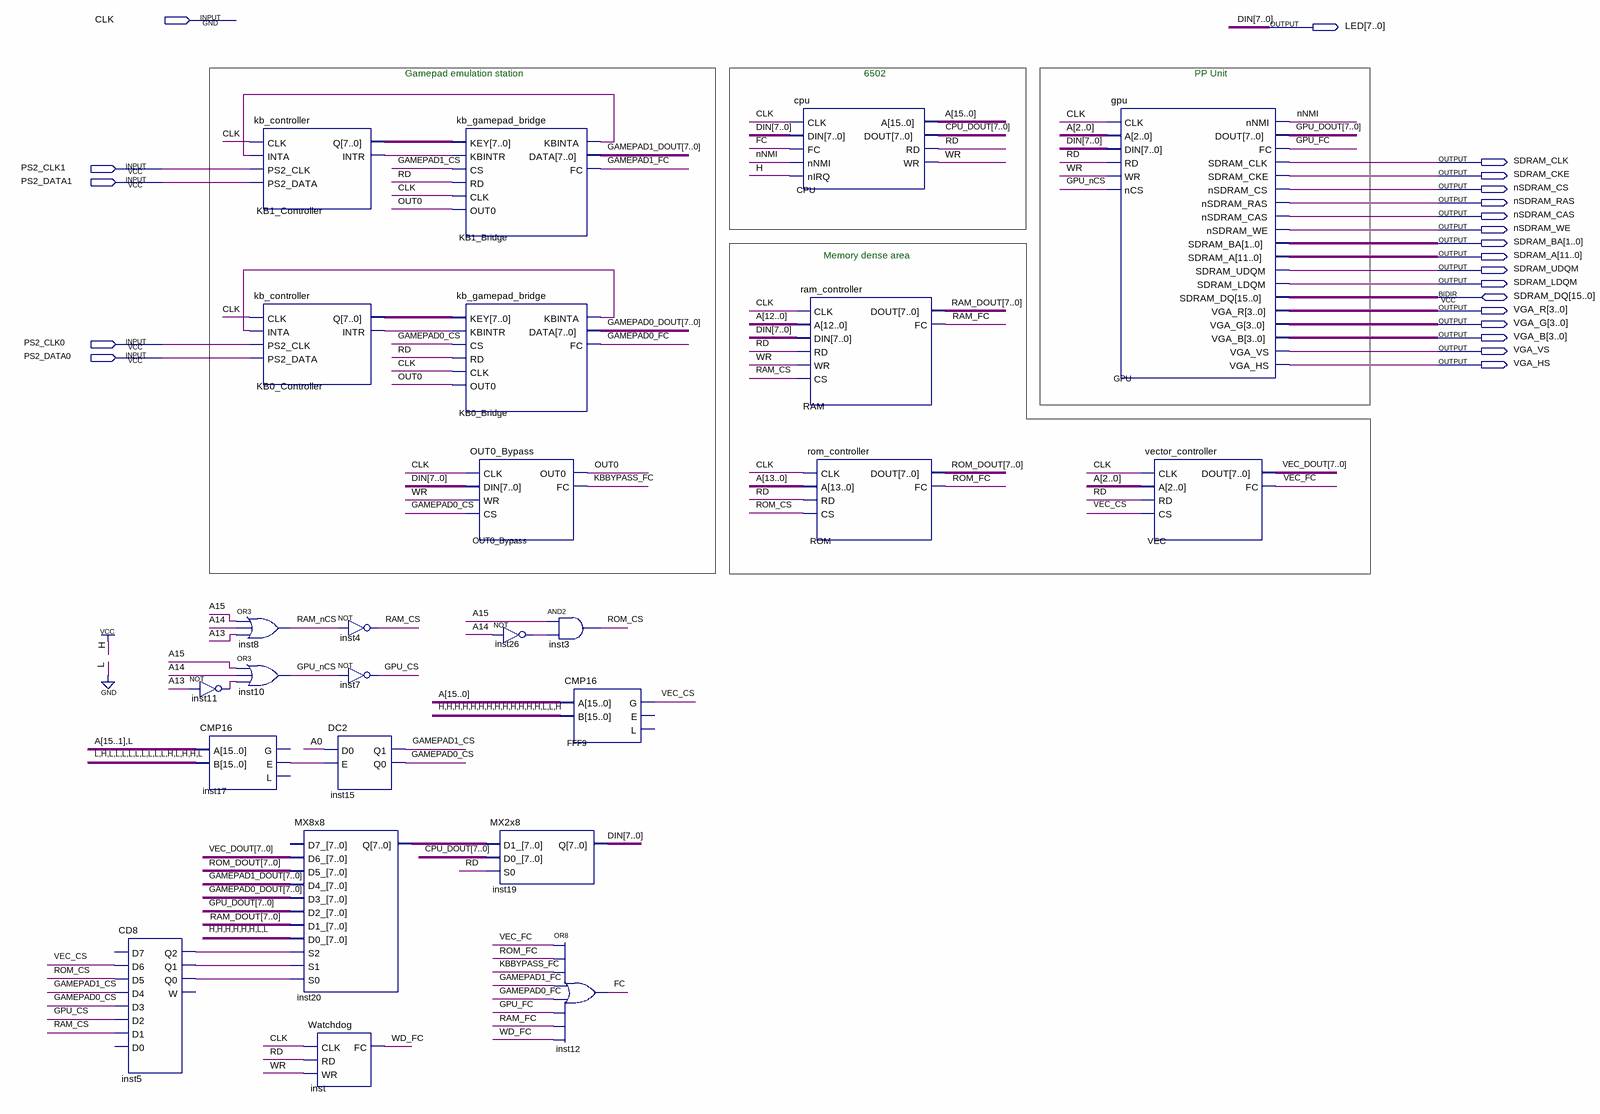
[diagram p0: schematic sheet]
// Quartus schematic nessy.bdf as structural Verilog: 25 symbols, 22 pins
module nessy (
  input  CLK,
  input  PS2_CLK1,
  input  PS2_DATA1,
  input  PS2_CLK0,
  input  PS2_DATA0,
  inout  [15:0] SDRAM_DQ,
  output [7:0] LED,
  output SDRAM_CLK,
  output SDRAM_CKE,
  output nSDRAM_CS,
  output nSDRAM_RAS,
  output nSDRAM_CAS,
  output nSDRAM_WE,
  output [1:0] SDRAM_BA,
  output [11:0] SDRAM_A,
  output SDRAM_UDQM,
  output SDRAM_LDQM,
  output [3:0] VGA_R,
  output [3:0] VGA_G,
  output [3:0] VGA_B,
  output VGA_VS,
  output VGA_HS
);

  wire FC, GAMEPAD0_CS, GAMEPAD0_FC, GAMEPAD1_CS, GAMEPAD1_FC, GPU_CS, GPU_FC, GPU_nCS, inst5_q0, inst5_q1,
       inst5_q2, inst11_out, inst17_e, inst26_out, KB0_Bridge_kbinta, KB0_Controller_intr, KB1_Bridge_kbinta,
       KB1_Controller_intr, KBBYPASS_FC, nNMI, OUT0, RAM_CS, RAM_FC, RAM_nCS, RD, ROM_CS, ROM_FC, VEC_CS,
       VEC_FC, WD_FC, WR;
  wire [7:0] CPU_DOUT, GAMEPAD0_DOUT, GAMEPAD1_DOUT, GPU_DOUT, inst20_q, KB0_Controller_q, KB1_Controller_q,
       RAM_DOUT, ROM_DOUT, VEC_DOUT;
  wire [15:0] A;

  CD8 inst5 (
    .D6(VEC_CS), .D5(ROM_CS), .D4(GAMEPAD1_CS), .D3(GAMEPAD0_CS), .D2(GPU_CS), .D1(RAM_CS), .Q2(inst5_q2),
    .Q1(inst5_q1), .Q0(inst5_q0));  // open: D7, D0, W
  not inst11 (inst11_out, A[13]);
  CMP16 inst17 (.A({A[15:1], 1'b0}), .B(16'b0100000000010110), .E(inst17_e));  // open: G, L
  kb_controller KB1_Controller (
    .CLK(CLK), .INTA(KB1_Bridge_kbinta), .PS2_CLK(PS2_CLK1), .PS2_DATA(PS2_DATA1), .Q(KB1_Controller_q),
    .INTR(KB1_Controller_intr));
  kb_controller KB0_Controller (
    .CLK(CLK), .INTA(KB0_Bridge_kbinta), .PS2_CLK(PS2_CLK0), .PS2_DATA(PS2_DATA0), .Q(KB0_Controller_q),
    .INTR(KB0_Controller_intr));
  or inst8 (RAM_nCS, A[15], A[14], A[13]);
  or inst10 (GPU_nCS, A[15], A[14], inst11_out);
  MX8x8 inst20 (
    .D6_(VEC_DOUT), .D5_(ROM_DOUT), .D4_(GAMEPAD1_DOUT), .D3_(GAMEPAD0_DOUT), .D2_(GPU_DOUT), .D1_(RAM_DOUT),
    .D0_(8'b11111100), .S2(inst5_q2), .S1(inst5_q1), .S0(inst5_q0), .Q(inst20_q));  // open: D7_
  Watchdog inst (.CLK(CLK), .RD(RD), .WR(WR), .FC(WD_FC));
  not inst4 (RAM_CS, RAM_nCS);
  not inst7 (GPU_CS, GPU_nCS);
  DC2 inst15 (.D0(A[0]), .E(inst17_e), .Q1(GAMEPAD1_CS), .Q0(GAMEPAD0_CS));
  kb_gamepad_bridge KB1_Bridge (
    .KEY(KB1_Controller_q), .KBINTR(KB1_Controller_intr), .CS(GAMEPAD1_CS), .RD(RD), .CLK(CLK), .OUT0(OUT0),
    .KBINTA(KB1_Bridge_kbinta), .DATA(GAMEPAD1_DOUT), .FC(GAMEPAD1_FC));
  kb_gamepad_bridge KB0_Bridge (
    .KEY(KB0_Controller_q), .KBINTR(KB0_Controller_intr), .CS(GAMEPAD0_CS), .RD(RD), .CLK(CLK), .OUT0(OUT0),
    .KBINTA(KB0_Bridge_kbinta), .DATA(GAMEPAD0_DOUT), .FC(GAMEPAD0_FC));
  OUT0_Bypass OUT0_Bypass (.CLK(CLK), .DIN(LED), .WR(WR), .CS(GAMEPAD0_CS), .OUT0(OUT0), .FC(KBBYPASS_FC));
  not inst26 (inst26_out, A[14]);
  MX2x8 inst19 (.D1_(inst20_q), .D0_(CPU_DOUT), .S0(RD), .Q(LED));
  and inst3 (ROM_CS, A[15], inst26_out);
  CMP16 FFF9 (.A(A), .B(16'b1111111111111001), .G(VEC_CS));  // open: E, L
  or inst12 (FC, VEC_FC, ROM_FC, KBBYPASS_FC, GAMEPAD1_FC, GAMEPAD0_FC, GPU_FC, RAM_FC, WD_FC);
  cpu CPU (.CLK(CLK), .DIN(LED), .FC(FC), .nNMI(nNMI), .nIRQ(1'b1), .A(A), .DOUT(CPU_DOUT), .RD(RD), .WR(WR));
  ram_controller RAM (.CLK(CLK), .A(A[12:0]), .DIN(LED), .RD(RD), .WR(WR), .CS(RAM_CS), .DOUT(RAM_DOUT), .FC(RAM_FC));
  rom_controller ROM (.CLK(CLK), .A(A[13:0]), .RD(RD), .CS(ROM_CS), .DOUT(ROM_DOUT), .FC(ROM_FC));
  gpu GPU (
    .CLK(CLK), .A(A[2:0]), .DIN(LED), .RD(RD), .WR(WR), .nCS(GPU_nCS), .nNMI(nNMI), .DOUT(GPU_DOUT),
    .FC(GPU_FC), .SDRAM_CLK(SDRAM_CLK), .SDRAM_CKE(SDRAM_CKE), .nSDRAM_CS(nSDRAM_CS),
    .nSDRAM_RAS(nSDRAM_RAS), .nSDRAM_CAS(nSDRAM_CAS), .nSDRAM_WE(nSDRAM_WE), .SDRAM_BA(SDRAM_BA),
    .SDRAM_A(SDRAM_A), .SDRAM_UDQM(SDRAM_UDQM), .SDRAM_LDQM(SDRAM_LDQM), .VGA_R(VGA_R), .VGA_G(VGA_G),
    .VGA_B(VGA_B), .VGA_VS(VGA_VS), .VGA_HS(VGA_HS), .SDRAM_DQ(SDRAM_DQ));
  vector_controller VEC (.CLK(CLK), .A(A[2:0]), .RD(RD), .CS(VEC_CS), .DOUT(VEC_DOUT), .FC(VEC_FC));

  // Other names for the same wires on the sheet: DIN[7:0] = LED

  // Notes on the sheet:
  //   Gamepad emulation station
  //   6502
  //   PP Unit
  //   Memory dense area
endmodule
